# EAGLE design executingModule (EAGLE 5.06)
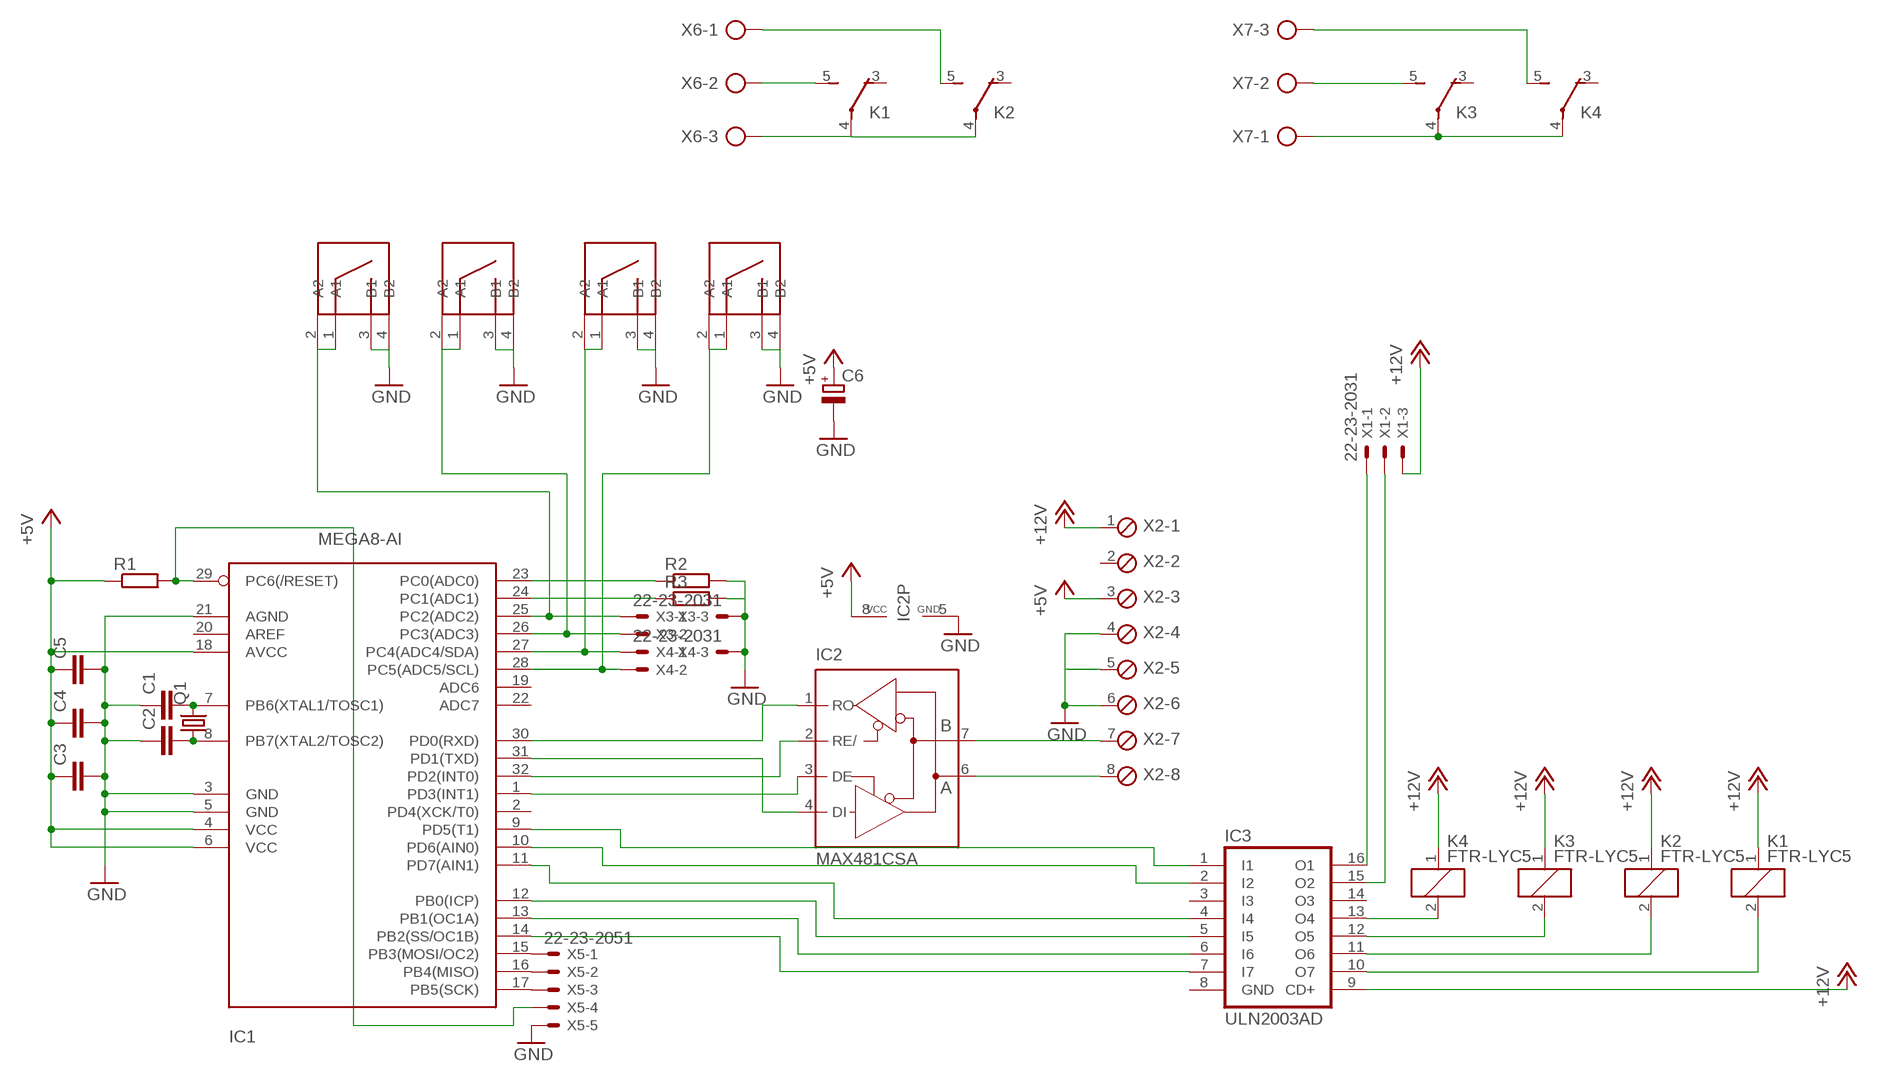
[diagram p0: schematic, sheet 1]

## Parts
C1  C-EUC0805  [C0805]
C2  C-EUC0805  [C0805]
C3  C-EUC1206  [C1206]
C4  C-EUC0805  [C0805]
C5  C-EUC0805  [C0805]
C6  CPOL-EUE2.5-6  [E2,5-6]
IC1  MEGA8-AI  [TQFP32-08]
IC2  MAX481CSA  [SO08]
IC3  ULN2003AD  [SO16]
K1  FTR-LYC5  [FTR-LYC]
K2  FTR-LYC5  [FTR-LYC]
K3  FTR-LYC5  [FTR-LYC]
K4  FTR-LYC5  [FTR-LYC]
Q1  CRYTALHC49S  [HC49/S]
R1  R-EU_R0805  [R0805]
R2  R-EU_R0805  [R0805]
R3  R-EU_R0805  [R0805]
U$2  KL2  [KL2]
U$3  KL2  [KL2]
U$4  KL2  [KL2]
U$5  KL2  [KL2]
X1  22-23-2031  [22-23-2031]
X2  MPT8  [8POL254]
X3  22-23-2031  [22-23-2031]
X4  22-23-2031  [22-23-2031]
X5  22-23-2051  [22-23-2051]
X6  AK500/3-H  [AK500/3-H]
X7  AK500/3-H  [AK500/3-H]

## Nets
!RXD_EN: IC1.32(PD2(INT0)) IC2.2(RE/)
+5V: C3.1 C4.1 C5.1 C6.+ IC1.4(VCC) IC1.6(VCC) IC1.18(AVCC) IC2.8(VCC) R1.1 X2.3
+12V: IC3.9(CD+) K1.1 K2.1 K3.1 K4.1 X1.3 X2.1
A: IC2.6(A) X2.8
B: IC2.7(B) X2.7
GND: C1.1 C2.1 C3.2 C4.2 C5.2 C6.- IC1.3(GND) IC1.5(GND) IC1.21(AGND) IC2.5(GND) R2.2 R3.2 U$2.3(B1) U$2.4(B2) U$3.3(B1) U$3.4(B2) U$4.3(B1) U$4.4(B2) U$5.3(B1) U$5.4(B2) X2.4 X2.5 X2.6 X3.3 X4.3 X5.5
N$1: IC1.23(PC0(ADC0)) R2.1
N$2: IC1.24(PC1(ADC1)) R3.1
N$5: IC1.17(PB5(SCK)) X5.3
N$6: IC1.15(PB3(MOSI/OC2)) X5.1
N$7: IC1.16(PB4(MISO)) X5.2
N$8: IC1.14(PB2(SS/OC1B)) IC3.7(I7)
N$9: IC1.13(PB1(OC1A)) IC3.6(I6)
N$10: IC1.12(PB0(ICP)) IC3.5(I5)
N$11: IC1.11(PD7(AIN1)) IC3.4(I4)
N$12: C1.2 IC1.7(PB6(XTAL1/TOSC1)) Q1.2
N$13: C2.2 IC1.8(PB7(XTAL2/TOSC2)) Q1.1
N$18: IC1.29(PC6(/RESET)) R1.2 X5.4
N$23: IC3.10(O7) K1.2
N$24: IC3.11(O6) K2.2
N$25: IC3.13(O4) K4.2
N$26: IC3.12(O5) K3.2
N$27: K1.4(-1:P) K2.4(-1:P) X6.3
N$28: K1.5(-1:S) X6.2
N$29: K2.5(-1:S) X6.1
N$30: K3.4(-1:P) K4.4(-1:P) X7.1
N$31: K3.5(-1:S) X7.2
N$32: K4.5(-1:S) X7.3
N$33: IC1.9(PD5(T1)) IC3.1(I1)
N$34: IC1.10(PD6(AIN0)) IC3.2(I2)
N$35: IC3.16(O1) X1.1
N$36: IC3.15(O2) X1.2
PC2: IC1.25(PC2(ADC2)) U$2.1(A1) U$2.2(A2) X3.1
PC3: IC1.26(PC3(ADC3)) U$3.1(A1) U$3.2(A2) X3.2
PC4: IC1.27(PC4(ADC4/SDA)) U$4.1(A1) U$4.2(A2) X4.1
PC5: IC1.28(PC5(ADC5/SCL)) U$5.1(A1) U$5.2(A2) X4.2
RXD: IC1.30(PD0(RXD)) IC2.1(RO)
TXD: IC1.31(PD1(TXD)) IC2.4(DI)
TXD_EN: IC1.1(PD3(INT1)) IC2.3(DE)
Unconnected: IC1.2(PD4(XCK/T0)) IC1.19(ADC6) IC1.20(AREF) IC1.22(ADC7) IC3.3(I3) IC3.14(O3) K1.3(-1:O) K2.3(-1:O) K3.3(-1:O) K4.3(-1:O) X2.2

## Power pins joined to a net without a drawn wire
GND: IC3.8(GND)

## Library data of the parts
C1-C5 = rcl:C-EU: CAPACITOR, European symbol
C6 = rcl:CPOL-EU: POLARIZED CAPACITOR, European symbol
IC1 = atmel:MEGA8: MICROCONTROLLER 8 Kbytes FLASH 1 kbytes SRAM 512 bytes EEPROM USART 6-channel 10 bit ADC 2-channel 8 bit ADC Source: avr.lbr
IC2 = maxim:MAX481CSA: RS485 TRANSEIVER
IC3 = uln-udn:ULN2003A: DRIVER ARRAY
K1-K4 = relay:FTR-LYC: Schmales Netzrelais NETZRELAIS FTR-LYCA024V 1XUM 6A/250VAC Distributor: Conrad electronic Bestell Nr.: 504382 - 62 Source: http://www2.produktinfo.conrad.com/datenblaetter/500000-524999/504382-da-01-de-NETZRELAIS_FTR-LYCA024V_1XUM_6A_250VAC.pdf
Q1 = crystal:CRYTAL: CRYSTAL
R1-R3 = rcl:R-EU_: RESISTOR, European symbol
U$2-U$5 = solarium:KL2
X1 X3 X4 = con-molex:22-23-2031: .100" (2.54mm) Center Header - 3 Pin
X2 = con-phoenix-254:MPT8: PHOENIX CONNECTOR
X5 = con-molex:22-23-2051: .100" (2.54mm) Center Header - 5 Pin
X6 X7 = con-ptr500:AK500/3-H: CONNECTOR Aug. 2004 / PTR Meßtechnik: Die Bezeichnung der Serie AK505 wurde geändert. Es handelt sich hierbei um AK500 in horizontaler Ausführung.

## Board
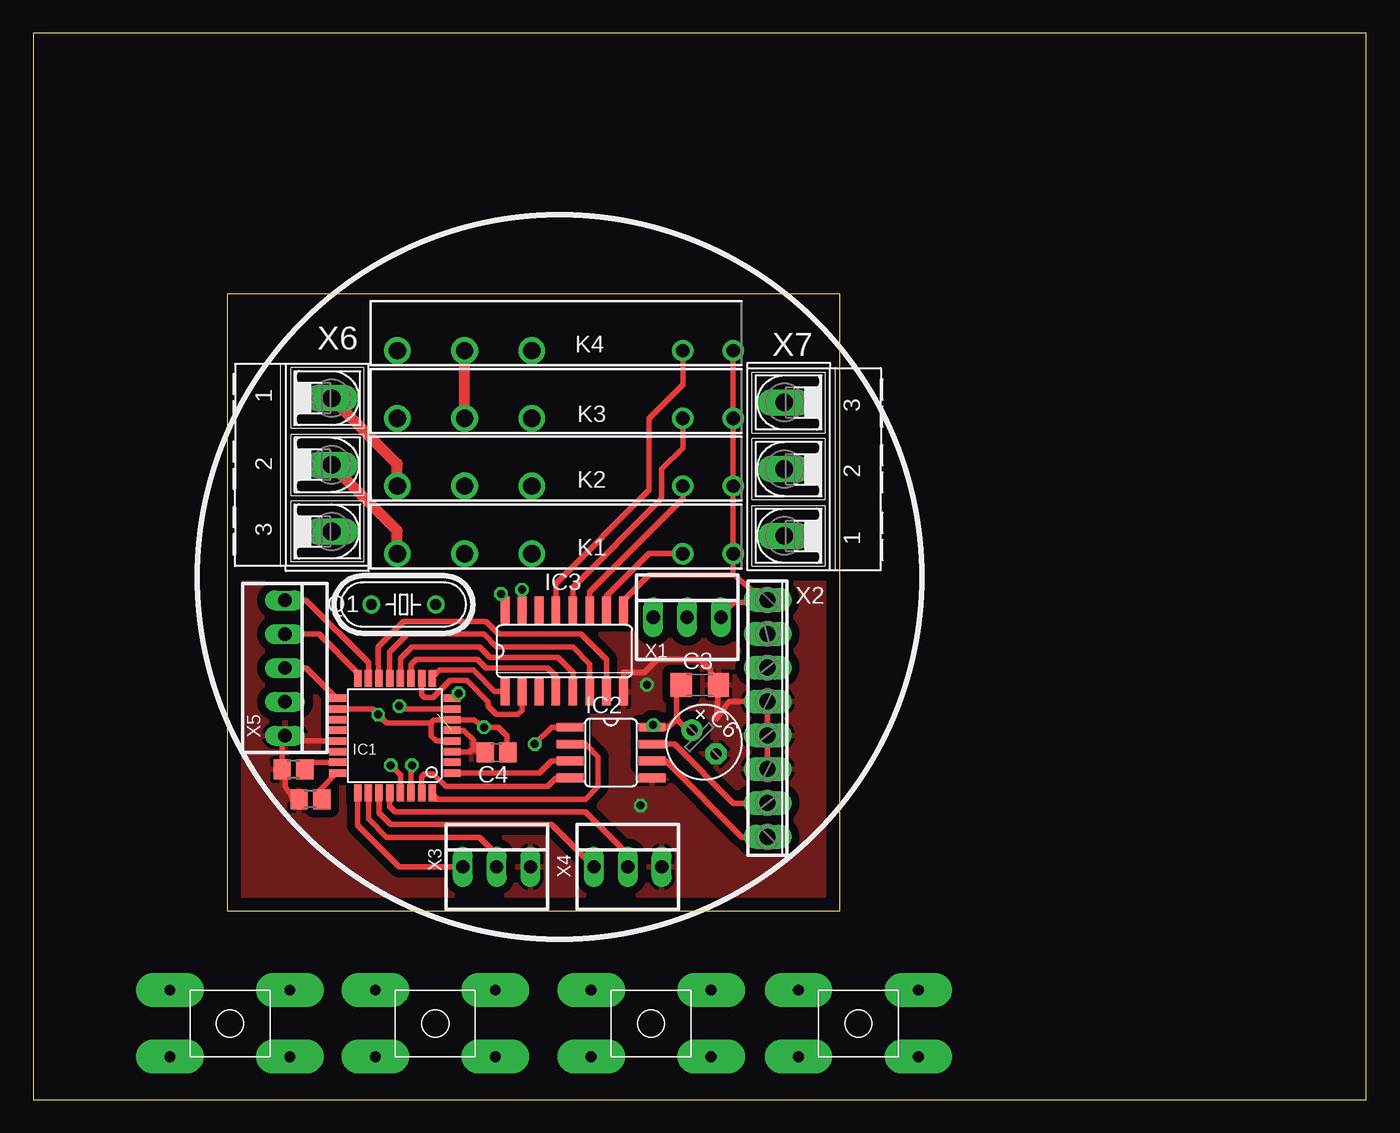
[diagram p1: board, top side]
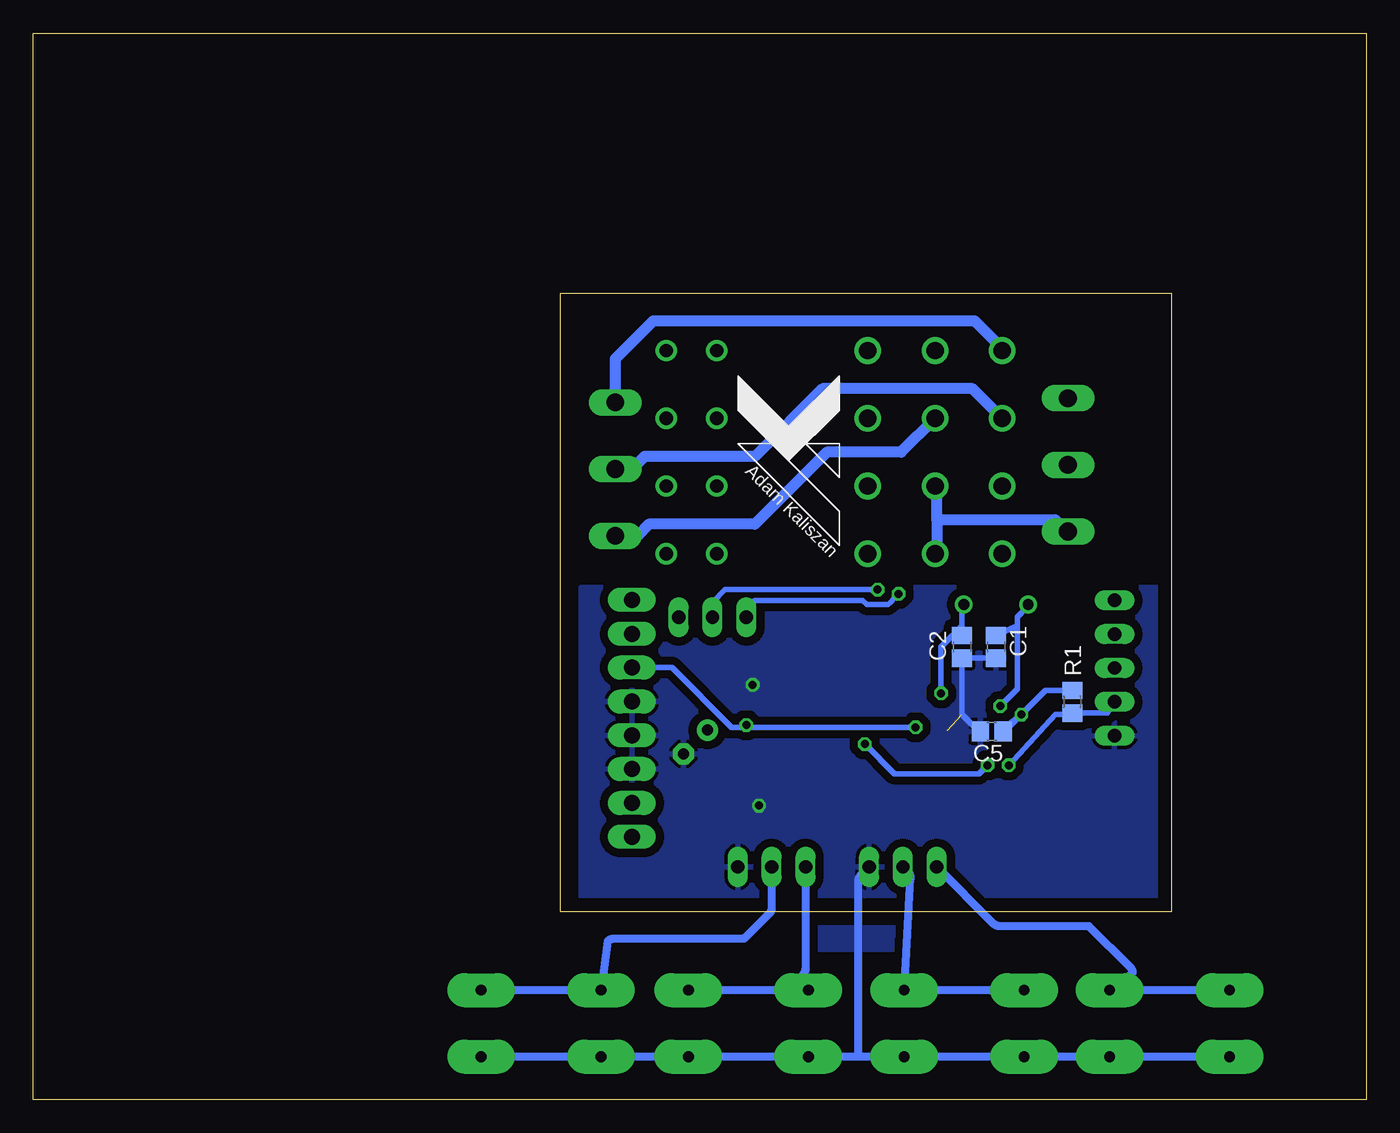
[diagram p2: board, bottom side, seen from below]

Size 100 x 80 mm. Coordinates in mm from the lower left corner, seen from the top.
Outline: 0,0 100,0 100,80 0,80 0,0
Outline: 14.6,60.48 60.48,60.48 60.48,14.12 14.6,14.12 14.6,60.48
Copper layers (1*16): Top 0.035mm / dielectric 1.5mm / Bottom 0.035mm
Design rules "default": minimum track width 10mil, minimum drill 24mil, track to track 8mil, track to pad 8mil, pad to pad 8mil, via to via 8mil, smd to smd 8mil, copper to edge 40mil, drill to drill 8mil, minimum pad ring 10mil, minimum via ring 8mil, stop-mask expansion 4mil, vias tented up to drill 0mil, thermal gap 10mil

### Footprints (pad centres in the part's own frame; a part is rotated, then mirrored left to right if it is on the bottom)
C0805 = smd 1.3 x 1.5: 1 -0.85,0; 2 0.85,0
C1206 = smd 1.6 x 1.8: 1 -1.4,0; 2 1.4,0
E2,5-6 = drill 0.813 pad 1.6 round: + -1.27,0 | drill 0.813 pad 1.6 octagon: - 1.27,0
TQFP32-08 = smd 1.27 x 0.559: 1 -4.293,2.8; 2 -4.293,2; 3 -4.293,1.2; 4 -4.293,0.4; 5 -4.293,-0.4; 6 -4.293,-1.2; 7 -4.293,-2; 8 -4.293,-2.8; 17 4.293,-2.8; 18 4.293,-2; 19 4.293,-1.2; 20 4.293,-0.4; 21 4.293,0.4; 22 4.293,1.2; 23 4.293,2; 24 4.293,2.8 | smd 0.559 x 1.27: 9 -2.8,-4.293; 10 -2,-4.293; 11 -1.2,-4.293; 12 -0.4,-4.293; 13 0.4,-4.293; 14 1.2,-4.293; 15 2,-4.293; 16 2.8,-4.293; 25 2.8,4.293; 26 2,4.293; 27 1.2,4.293; 28 0.4,4.293; 29 -0.4,4.293; 30 -1.2,4.293; 31 -2,4.293; 32 -2.8,4.293
SO08 = smd 0.66 x 2.032: 1 -1.905,-3.073; 2 -0.635,-3.073; 3 0.635,-3.073; 4 1.905,-3.073; 5 1.905,3.073; 6 0.635,3.073; 7 -0.635,3.073; 8 -1.905,3.073
SO16 = smd 0.66 x 2.032: 1 -4.445,-3.073; 2 -3.175,-3.073; 3 -1.905,-3.073; 4 -0.635,-3.073; 5 0.635,-3.073; 6 1.905,-3.073; 7 3.175,-3.073; 8 4.445,-3.073; 9 4.445,3.073; 10 3.175,3.073; 11 1.905,3.073; 12 0.635,3.073; 13 -0.635,3.073; 14 -1.905,3.073; 15 -3.175,3.073; 16 -4.445,3.073
FTR-LYC = drill 1 pad 1.6 round: 1 -3.78,0; 2 0,0 | drill 1.3 pad 2 round: 3 11.34,0; 4 16.38,0; 5 21.42,0
HC49/S = drill 0.813 round: 1 -2.413,0; 2 2.413,0
R0805 = smd 1.3 x 1.5: 1 -0.85,0; 2 0.85,0
KL2 = drill 0.8 pad 2.54 long: 1 -4.5,-2.5; 2 4.5,-2.5; 3 4.5,2.5; 4 -4.5,2.5
22-23-2031 = drill 1 long: 1 -2.54,0; 2 0,0; 3 2.54,0
8POL254 = drill 1.2 long: 1 -8.89,0; 2 -6.35,0; 3 -3.81,0; 4 -1.27,0; 5 1.27,0; 6 3.81,0; 7 6.35,0; 8 8.89,0
22-23-2051 = drill 1 long: 1 -5.08,0; 2 -2.54,0; 3 0,0; 4 2.54,0; 5 5.08,0
AK500/3-H = drill 1.321 long: 1 -5.004,0; 2 0,0; 3 5.004,0

### Placement (x,y rotation side)
C1  27.77,33.97 90 bottom
C2  30.31,33.97 90 bottom
C3  50,31.11 0 top
C4  34.76,26.03 180 top
C5  28.09,27.62 180 bottom
C6  50.32,26.82 315 top
IC1  27.14,27.3 180 top
IC2  43.33,26.03 270 top
IC3  39.84,33.65 0 top
K1  48.73,40.95 180 top
K2  48.73,46.03 180 top
K3  48.73,51.11 180 top
K4  48.73,56.19 180 top
Q1  27.77,37.14 180 top
R1  22.06,29.84 270 bottom
R2  19.52,24.76 180 top
R3  20.79,22.54 180 top
U$1  [LOGOBIALE]  43.33,47.94 90 bottom
U$2  14.76,5.71 180 top
U$3  30.16,5.71 180 top
U$4  46.35,5.71 180 top
U$5  61.91,5.71 180 top
X1  49.05,36.19 0 top
X2  55.08,28.6 270 top
X3  34.76,17.46 0 top
X4  44.6,17.46 0 top
X5  18.88,32.38 270 top
X6  22.38,47.62 270 top
X7  56.35,47.3 90 top

### Tracks (layer width: path | path; a pad name or v marks a point on that pad's centre or on a via)
!RXD_EN
  Top 0.406: IC1.32 29.94,22.91 30.31,22.54 41.43,22.54 42.38,23.49 42.38,25.71 41.43,26.66 IC2.2 40.16,26.66
+5V  (via drill 0.6)
  Top 0.406: IC1.4 30.24,26.9 29.84,27.3 29.84,28.25 | 29.84,28.25 30.09,28.5 IC1.6 33.08,28.5 v33.81,27.93 34.92,27.93 35.55,27.3 35.55,26.03 C4.1 | 29.84,28.25 26.5,28.25 v25.87,28.89 25.46,29.3 IC1.18 | v46.51,28.09 IC2.8 | v46.51,28.09 46.82,27.93 | 48.25,28.89 48.25,28.57 47.62,27.93 46.67,27.93 v46.51,28.09 | 48.25,28.89 48.25,30.32 C3.1 | v46.51,28.09 | C6.+ 49.42,27.4 48.33,28.49 48.33,28.81 48.25,28.89
  Bottom 0.406: v33.81,27.93 46.35,27.93 v46.51,28.09 | 27.14,27.62 C5.1 | R1.1 24.07,30.69 27.14,27.62 | 27.14,27.62 27.14,27.93 v25.87,28.89 | X2.3 52.09,32.41 47.62,27.93 46.67,27.93 v46.51,28.09 | v46.51,28.09
+12V
  Top 0.406: IC3.9 44.28,37.46 46.19,39.37 52.51,39.37 52.51,39.42 | 52.51,39.42 K1.1 K2.1 K3.1 K4.1 | 52.51,39.42 54.76,37.49 X2.1 54.58,37.3 52.54,37.3 51.59,36.35 X1.3
A
  Top 0.406: IC2.6 47.46,25.39 53.17,19.68 53.78,19.68 X2.8
B
  Top 0.406: IC2.7 48.09,26.66 52.54,22.22 53.78,22.22 X2.7
GND  (via drill 0.6)  (1 unrouted)
  Top 0.406: IC3.8 44.28,32.06 45.87,32.06 46.82,33.02 50,33.02 50.79,32.22 50.79,32.06 51.4,31.46 C3.2 51.27,28.57 52.19,29.87 X2.4 X2.5 X2.6 | IC1.3 32.77,26.1 33.01,26.35 | IC1.5 32.3,27.7 33.01,26.98 33.01,26.35 | IC1.21 18.65,26.9 X5.5 18.67,27.08 R2.2 18.88,24.12 18.88,23.49 19.52,22.54 R3.2 | C4.2 33.39,26.13 33.01,26.35
  Bottom 0.406: C1.1 30.21,33.12 30.31,33.33 C2.1 30.31,28.89 29.04,27.62 C5.2
  Bottom 0.61: U$2.3 U$2.4 25.18,3.21 arc90 U$3.3 U$3.4 | U$5.4 U$5.3 U$4.4 U$4.3 34.18,3.21 arc-53 U$3.4 | U$3.4 37.81,3.21 arc45 38.09,3.33 38.09,16.4 arc45 37.91,16.85 X3.3
  other vias: 46.03,31.11 45.55,22.06
  pour Bottom (isolate 0.61): 9.84,38.41 58.89,38.41 58.89,11.27 9.84,11.27
  pour Top (isolate 0.61): 12.22,38.89 12.22,11.27 59.52,11.27 59.52,38.73 12.38,38.73
N$1
  Top 0.406: R2.1 20.47,24.76 20.38,25.3 IC1.23
N$2
  Top 0.406: IC1.24 22.75,24.5 21.42,23.17 21.42,22.22 R3.1
N$5
  Top 0.406: IC1.17 22.75,30.1 20.47,32.38 X5.3
N$6
  Top 0.406: IC1.15 25.14,32.79 20.47,37.46 X5.1
N$7
  Top 0.406: IC1.16 24.34,32.01 21.42,34.92 X5.2
N$8
  Top 0.406: IC1.14 25.87,32.86 25.87,33.97 27.77,35.87 33.97,35.87 34.92,34.92 41.11,34.92 43.02,33.02 IC3.7
N$9
  Top 0.406: IC1.13 26.74,33.57 28.09,34.92 33.81,34.92 34.76,33.97 40.48,33.97 41.74,32.7 IC3.6
N$10
  Top 0.406: IC1.12 27.54,33.1 28.41,33.97 33.49,33.97 34.28,33.17 39.36,33.17 40.48,32.06 IC3.5
N$11
  Top 0.406: IC1.11 28.34,32.63 28.73,33.02 33.33,33.02 33.97,32.38 38.57,32.38 39.2,31.74 IC3.4
N$12  (via drill 0.6)
  Top 0.406: IC1.7 27.68,29.3 v27.46,29.52
  Bottom 0.406: 26.19,36.19 26.19,35.24 26.4,35.45 C1.2 | v27.46,29.52 26.19,30.79 26.19,36.19 | Q1.2 25.87,36.51 26.19,36.19
N$13  (via drill 0.6)
  Top 0.406: IC1.8 31.32,30.1 31.27,30.16 31.74,30.16 31.9,30.32 v31.9,30.47
  Bottom 0.406: Q1.1 30.31,37.14 30.31,35.24 | 30.31,35.24 C2.2 31.05,34.82 31.9,33.97 v31.9,30.47 | 30.31,35.24 30.31,35.55 30.63,35.24 30.31,35.24
N$18  (via drill 0.6)
  Top 0.406: IC1.29 27.54,24.36 v26.82,25.08
  Bottom 0.406: v26.82,25.08 23.33,28.89 21.42,28.89 R1.2 19.42,28.99 X5.4
N$23
  Top 0.406: IC3.10 43.02,37.78 46.19,40.95 K1.2
N$24
  Top 0.406: IC3.11 41.74,38.1 48.73,45.08 K2.2
N$25
  Top 0.406: IC3.13 39.2,38.73 46.19,45.72 46.19,51.11 48.73,53.65 K4.2
N$26
  Top 0.406: IC3.12 40.48,38.41 47.14,45.08 47.14,47.3 48.73,48.89 K3.2
N$27
  Bottom 0.813: X6.3 22.45,42.62 23.33,43.49 32.22,43.49 | 32.22,43.49 32.22,45.9 K2.4 | 32.22,43.49 32.22,41.08 K1.4
N$28
  Top 0.813: K1.5 27.31,42.69 X6.2
N$29
  Top 0.813: K2.5 27.31,47.69 X6.1
N$30
  Top 0.813: K3.4 K4.4
  Bottom 0.813: X7.1 54.69,42.3 53.81,43.18 45.87,43.18 40.48,48.57 34.89,48.57 K3.4
N$31
  Bottom 0.813: X7.2 55.08,47.3 54.13,48.26 45.87,48.26 40.79,53.34 29.53,53.34 K3.5
N$32
  Bottom 0.813: K4.5 27.31,56.36 29.36,58.41 53.49,58.41 56.35,55.56 X7.3
N$33
  Top 0.406: IC1.9 29.94,31.69 30.47,32.22 33.01,32.22 34.6,30.63 35.34,30.63 IC3.1
N$34
  Top 0.406: IC1.10 29.14,30.38 29.36,30.16 30,30.16 31.27,31.43 32.54,31.43 34.12,29.84 34.12,29.52 34.76,28.89 36.35,28.89 36.66,29.2 IC3.2
N$35  (via drill 0.6)
  Top 0.406: IC3.16 35.39,37.62 v35.08,37.94
  Bottom 0.406: v35.08,37.94 35.39,37.62 | 35.39,37.62 | 35.39,37.62 35.71,37.3 35.87,37.14 37.46,37.14 37.78,37.46 45.87,37.46 46.51,36.83 X1.1
N$36  (via drill 0.6)
  Top 0.406: IC3.15 v36.66,38.25
  Bottom 0.406: v36.66,38.25 48.09,38.25 49.05,37.3 X1.2
PC2
  Top 0.406: IC1.25 24.34,20.57 27.46,17.46 X3.1
  Bottom 0.61: X3.1 27.96,13.2 arc-45 27.51,13.01 20.79,13.01 17.7,9.92 arc45 17.51,9.47 U$2.1 U$2.2
PC3
  Top 0.406: IC1.26 25.14,21.04 26.5,19.68 33.49,19.68 34.76,18.41 X3.2
  Bottom 0.61: X3.2 34.37,17.06 arc45 34.18,16.61 U$3.1 U$3.2
PC4
  Top 0.406: IC1.27 25.94,21.52 26.82,20.63 38.89,20.63 X4.1
  Bottom 0.61: X4.1 42.06,9.85 arc45 42.25,9.4 U$4.2 U$4.1
PC5
  Top 0.406: IC1.28 26.74,21.98 27.14,21.58 41.43,21.58 44.6,18.41 X4.2
  Bottom 0.61: X4.2 44.6,14.39 arc45 44.79,13.94 46.67,12.06 56.47,12.06 arc-45 56.92,11.87 U$5.2 U$5.1
RXD  (via drill 0.6)
  Top 0.406: IC2.1 38.89,27.93 v37.62,26.66 | v28.41,25.08 28.41,24.76 28.34,24.69 IC1.30
  Bottom 0.406: v37.62,26.66 35.39,24.44 29.04,24.44 v28.41,25.08
TXD
  Top 0.406: IC2.4 39.2,24.12 38.57,23.49 30.95,23.49 30,24.44 29.36,24.44 29.14,24.22 IC1.31
TXD_EN
  Top 0.406: IC1.1 37.99,24.5 38.89,25.39 IC2.3